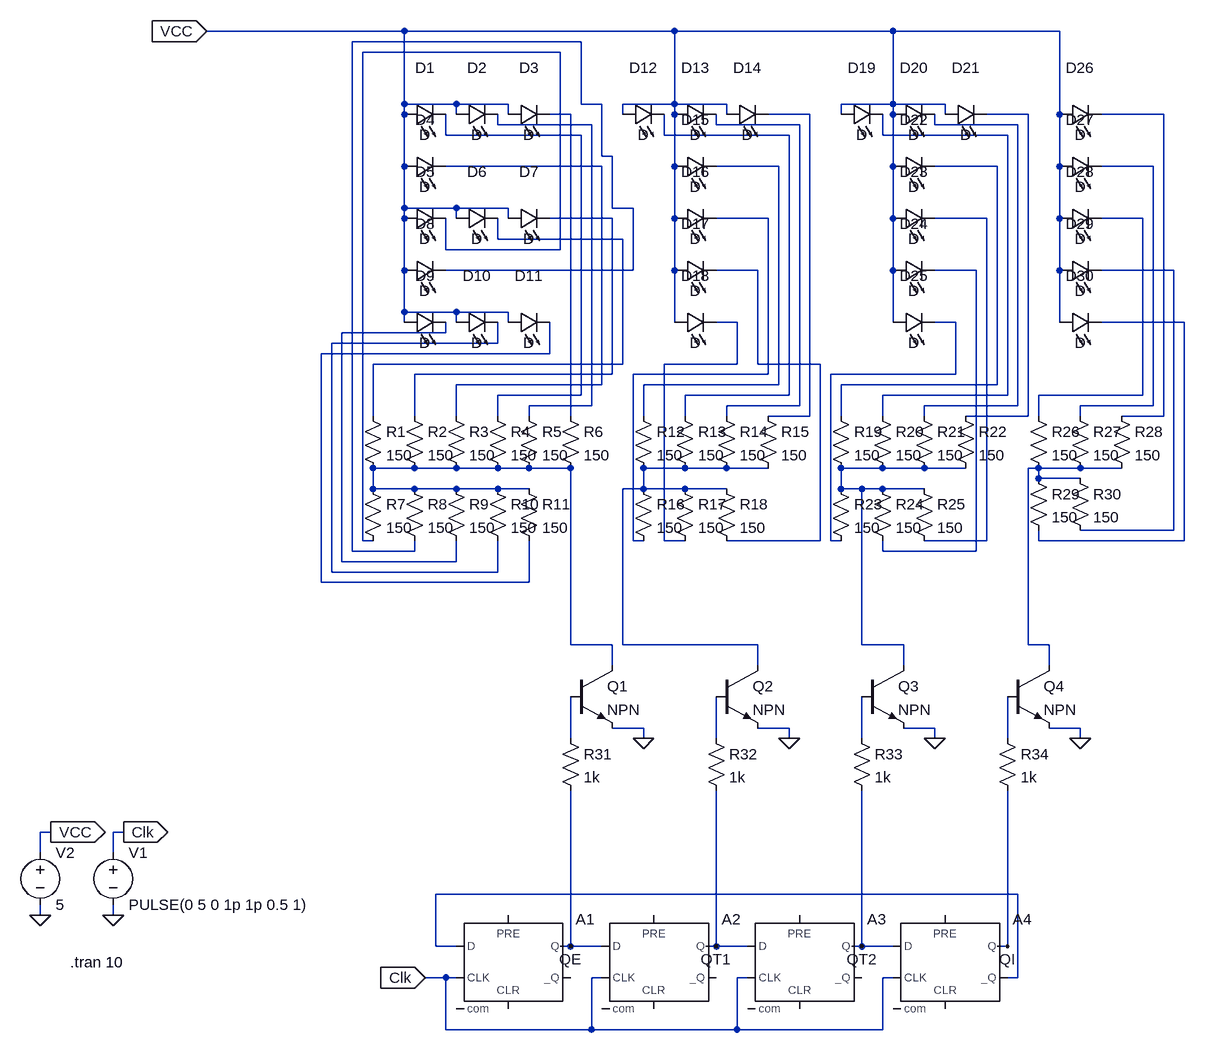
[diagram p0: schematic ETTI board LTSpice Model.asc]
ETTI board LTSpice Model.asc, the LTspice schematic file:
Version 4
SHEET 1 1332 680
WIRE 80 -944 -224 -944
WIRE 496 -944 80 -944
WIRE 832 -944 496 -944
WIRE 1088 -944 832 -944
WIRE 352 -928 0 -928
WIRE 320 -912 16 -912
WIRE 80 -832 80 -944
WIRE 160 -832 80 -832
WIRE 240 -832 160 -832
WIRE 352 -832 352 -928
WIRE 384 -832 352 -832
WIRE 496 -832 496 -944
WIRE 496 -832 416 -832
WIRE 576 -832 496 -832
WIRE 832 -832 832 -944
WIRE 832 -832 752 -832
WIRE 912 -832 832 -832
WIRE 80 -816 80 -832
WIRE 160 -816 160 -832
WIRE 240 -816 240 -832
WIRE 336 -816 304 -816
WIRE 416 -816 416 -832
WIRE 496 -816 496 -832
WIRE 576 -816 576 -832
WIRE 704 -816 640 -816
WIRE 752 -816 752 -832
WIRE 832 -816 832 -832
WIRE 912 -816 912 -832
WIRE 1040 -816 976 -816
WIRE 1088 -816 1088 -944
WIRE 1248 -816 1152 -816
WIRE 224 -800 224 -816
WIRE 368 -800 224 -800
WIRE 560 -800 560 -816
WIRE 688 -800 560 -800
WIRE 896 -800 896 -816
WIRE 1024 -800 896 -800
WIRE 144 -784 144 -816
WIRE 352 -784 144 -784
WIRE 480 -784 480 -816
WIRE 672 -784 480 -784
WIRE 816 -784 816 -816
WIRE 1008 -784 816 -784
WIRE 384 -752 384 -832
WIRE 400 -752 384 -752
WIRE 80 -736 80 -816
WIRE 384 -736 144 -736
WIRE 496 -736 496 -816
WIRE 656 -736 560 -736
WIRE 832 -736 832 -816
WIRE 992 -736 896 -736
WIRE 1088 -736 1088 -816
WIRE 1232 -736 1152 -736
WIRE 80 -672 80 -736
WIRE 160 -672 80 -672
WIRE 240 -672 160 -672
WIRE 400 -672 400 -752
WIRE 432 -672 400 -672
WIRE 80 -656 80 -672
WIRE 160 -656 160 -672
WIRE 240 -656 240 -672
WIRE 400 -656 304 -656
WIRE 496 -656 496 -736
WIRE 640 -656 560 -656
WIRE 832 -656 832 -736
WIRE 976 -656 896 -656
WIRE 1088 -656 1088 -736
WIRE 1216 -656 1152 -656
WIRE 224 -624 224 -656
WIRE 416 -624 224 -624
WIRE 144 -608 144 -656
WIRE 320 -608 320 -912
WIRE 320 -608 144 -608
WIRE 80 -576 80 -656
WIRE 432 -576 432 -672
WIRE 432 -576 144 -576
WIRE 496 -576 496 -656
WIRE 624 -576 560 -576
WIRE 832 -576 832 -656
WIRE 960 -576 896 -576
WIRE 1088 -576 1088 -656
WIRE 1264 -576 1152 -576
WIRE 80 -512 80 -576
WIRE 160 -512 80 -512
WIRE 240 -512 160 -512
WIRE 80 -496 80 -512
WIRE 160 -496 160 -512
WIRE 240 -496 240 -512
WIRE 496 -496 496 -576
WIRE 592 -496 560 -496
WIRE 832 -496 832 -576
WIRE 928 -496 896 -496
WIRE 1088 -496 1088 -576
WIRE 1280 -496 1152 -496
WIRE 144 -480 144 -496
WIRE 144 -480 -16 -480
WIRE 224 -464 224 -496
WIRE 224 -464 -32 -464
WIRE 304 -448 304 -496
WIRE 304 -448 -48 -448
WIRE 416 -432 416 -624
WIRE 416 -432 32 -432
WIRE 592 -432 592 -496
WIRE 592 -432 480 -432
WIRE 624 -432 624 -576
WIRE 720 -432 624 -432
WIRE 400 -416 400 -656
WIRE 400 -416 96 -416
WIRE 640 -416 640 -656
WIRE 640 -416 432 -416
WIRE 928 -416 928 -496
WIRE 928 -416 736 -416
WIRE 384 -400 384 -736
WIRE 384 -400 160 -400
WIRE 656 -400 656 -736
WIRE 656 -400 448 -400
WIRE 992 -400 992 -736
WIRE 992 -400 752 -400
WIRE 352 -384 352 -784
WIRE 352 -384 224 -384
WIRE 672 -384 672 -784
WIRE 672 -384 512 -384
WIRE 1008 -384 1008 -784
WIRE 1008 -384 816 -384
WIRE 1216 -384 1216 -656
WIRE 1216 -384 1056 -384
WIRE 368 -368 368 -800
WIRE 368 -368 272 -368
WIRE 688 -368 688 -800
WIRE 688 -368 576 -368
WIRE 1024 -368 1024 -800
WIRE 1024 -368 880 -368
WIRE 1232 -368 1232 -736
WIRE 1232 -368 1120 -368
WIRE 32 -352 32 -432
WIRE 96 -352 96 -416
WIRE 160 -352 160 -400
WIRE 224 -352 224 -384
WIRE 272 -352 272 -368
WIRE 336 -352 336 -816
WIRE 448 -352 448 -400
WIRE 512 -352 512 -384
WIRE 576 -352 576 -368
WIRE 704 -352 704 -816
WIRE 704 -352 640 -352
WIRE 752 -352 752 -400
WIRE 816 -352 816 -384
WIRE 880 -352 880 -368
WIRE 1040 -352 1040 -816
WIRE 1040 -352 944 -352
WIRE 1056 -352 1056 -384
WIRE 1120 -352 1120 -368
WIRE 1248 -352 1248 -816
WIRE 1248 -352 1184 -352
WIRE 96 -272 32 -272
WIRE 160 -272 96 -272
WIRE 224 -272 160 -272
WIRE 272 -272 224 -272
WIRE 336 -272 272 -272
WIRE 512 -272 448 -272
WIRE 576 -272 512 -272
WIRE 640 -272 576 -272
WIRE 816 -272 752 -272
WIRE 880 -272 816 -272
WIRE 944 -272 880 -272
WIRE 1056 -272 1040 -272
WIRE 1120 -272 1056 -272
WIRE 1184 -272 1120 -272
WIRE 1056 -256 1056 -272
WIRE 1120 -256 1056 -256
WIRE 32 -240 32 -272
WIRE 96 -240 32 -240
WIRE 160 -240 96 -240
WIRE 224 -240 160 -240
WIRE 272 -240 224 -240
WIRE 448 -240 448 -272
WIRE 448 -240 416 -240
WIRE 512 -240 448 -240
WIRE 576 -240 512 -240
WIRE 752 -240 752 -272
WIRE 784 -240 752 -240
WIRE 816 -240 784 -240
WIRE 880 -240 816 -240
WIRE 1264 -176 1264 -576
WIRE 1264 -176 1120 -176
WIRE 16 -160 16 -912
WIRE 32 -160 16 -160
WIRE 432 -160 432 -416
WIRE 448 -160 432 -160
WIRE 480 -160 480 -432
WIRE 512 -160 480 -160
WIRE 720 -160 720 -432
WIRE 720 -160 576 -160
WIRE 736 -160 736 -416
WIRE 752 -160 736 -160
WIRE 976 -160 976 -656
WIRE 976 -160 880 -160
WIRE 1056 -160 1056 -176
WIRE 1280 -160 1280 -496
WIRE 1280 -160 1056 -160
WIRE 0 -144 0 -928
WIRE 96 -144 96 -160
WIRE 96 -144 0 -144
WIRE 816 -144 816 -160
WIRE 960 -144 960 -576
WIRE 960 -144 816 -144
WIRE -16 -128 -16 -480
WIRE 160 -128 160 -160
WIRE 160 -128 -16 -128
WIRE -32 -112 -32 -464
WIRE 224 -112 224 -160
WIRE 224 -112 -32 -112
WIRE -48 -96 -48 -448
WIRE 272 -96 272 -160
WIRE 272 -96 -48 -96
WIRE 336 0 336 -272
WIRE 400 0 336 0
WIRE 416 0 416 -240
WIRE 624 0 416 0
WIRE 784 0 784 -240
WIRE 848 0 784 0
WIRE 1040 0 1040 -272
WIRE 1072 0 1040 0
WIRE 400 32 400 0
WIRE 624 32 624 0
WIRE 848 32 848 0
WIRE 1072 32 1072 0
WIRE 448 128 400 128
WIRE 672 128 624 128
WIRE 896 128 848 128
WIRE 1120 128 1072 128
WIRE 336 144 336 80
WIRE 448 144 448 128
WIRE 560 144 560 80
WIRE 672 144 672 128
WIRE 784 144 784 80
WIRE 896 144 896 128
WIRE 1008 144 1008 80
WIRE 1120 144 1120 128
WIRE -464 288 -480 288
WIRE -352 288 -368 288
WIRE -480 320 -480 288
WIRE -368 320 -368 288
WIRE 1024 384 128 384
WIRE -480 416 -480 400
WIRE -368 416 -368 400
WIRE 128 464 128 384
WIRE 160 464 128 464
WIRE 336 464 336 224
WIRE 336 464 320 464
WIRE 384 464 336 464
WIRE 560 464 560 224
WIRE 560 464 544 464
WIRE 608 464 560 464
WIRE 784 464 784 224
WIRE 784 464 768 464
WIRE 832 464 784 464
WIRE 1008 464 1008 224
WIRE 1008 464 992 464
WIRE 144 512 112 512
WIRE 160 512 144 512
WIRE 384 512 368 512
WIRE 608 512 592 512
WIRE 832 512 816 512
WIRE 1024 512 1024 384
WIRE 1024 512 1008 512
WIRE 144 592 144 512
WIRE 368 592 368 512
WIRE 368 592 144 592
WIRE 592 592 592 512
WIRE 592 592 368 592
WIRE 816 592 816 512
WIRE 816 592 592 592
FLAG -368 416 0
FLAG -352 288 Clk
IOPIN -352 288 Out
FLAG 112 512 Clk
IOPIN 112 512 In
FLAG -480 416 0
FLAG 448 144 0
FLAG 672 144 0
FLAG 896 144 0
FLAG 1120 144 0
FLAG -464 288 VCC
IOPIN -464 288 Out
FLAG -224 -944 VCC
IOPIN -224 -944 In
FLAG 336 464 QE
FLAG 560 464 QT1
FLAG 784 464 QT2
FLAG 1008 464 QI
SYMBOL Digital\\dflop 240 416 R0
WINDOW 3 0 0 Invisible 0
SYMATTR InstName A1
SYMATTR SpiceLine Td=2n Trise=10n Tfall=10n
SYMATTR Value2 Vhigh=5  Vlow=0
SYMATTR Value Ref=2.5
SYMATTR SpiceLine2 tripdt=5n
SYMBOL Digital\\dflop 464 416 R0
WINDOW 3 0 0 Invisible 0
SYMATTR InstName A2
SYMATTR SpiceLine Td=2n Trise=10n Tfall=10n
SYMATTR Value2 Vhigh=5  Vlow=0
SYMATTR Value Ref=2.5
SYMATTR SpiceLine2 tripdt=5n
SYMBOL Digital\\dflop 688 416 R0
WINDOW 3 0 0 Invisible 0
SYMATTR InstName A3
SYMATTR SpiceLine Td=2n Trise=10n Tfall=10n
SYMATTR Value2 Vhigh=5  Vlow=0
SYMATTR Value Ref=2.5
SYMATTR SpiceLine2 tripdt=5n
SYMBOL Digital\\dflop 912 416 R0
WINDOW 3 0 0 Invisible 0
SYMATTR InstName A4
SYMATTR SpiceLine Td=2n Trise=10n Tfall=10n
SYMATTR Value2 Vhigh=5  Vlow=0
SYMATTR Value Ref=2.5
SYMATTR SpiceLine2 tripdt=5n
SYMBOL voltage -368 304 R0
WINDOW 123 0 0 Left 0
WINDOW 39 0 0 Left 0
SYMATTR InstName V1
SYMATTR Value PULSE(0 5 0 1p 1p 0.5 1)
SYMBOL LED 80 -800 R270
WINDOW 0 72 32 VTop 2
WINDOW 3 0 32 VBottom 2
SYMATTR InstName D1
SYMBOL LED 160 -800 R270
WINDOW 0 72 32 VTop 2
WINDOW 3 0 32 VBottom 2
SYMATTR InstName D2
SYMBOL LED 240 -800 R270
WINDOW 0 72 32 VTop 2
WINDOW 3 0 32 VBottom 2
SYMATTR InstName D3
SYMBOL LED 80 -720 R270
WINDOW 0 72 32 VTop 2
WINDOW 3 0 32 VBottom 2
SYMATTR InstName D4
SYMBOL LED 80 -640 R270
WINDOW 0 72 32 VTop 2
WINDOW 3 0 32 VBottom 2
SYMATTR InstName D5
SYMBOL LED 160 -640 R270
WINDOW 0 72 32 VTop 2
WINDOW 3 0 32 VBottom 2
SYMATTR InstName D6
SYMBOL LED 240 -640 R270
WINDOW 0 72 32 VTop 2
WINDOW 3 0 32 VBottom 2
SYMATTR InstName D7
SYMBOL LED 80 -560 R270
WINDOW 0 72 32 VTop 2
WINDOW 3 0 32 VBottom 2
SYMATTR InstName D8
SYMBOL LED 80 -480 R270
WINDOW 0 72 32 VTop 2
WINDOW 3 0 32 VBottom 2
SYMATTR InstName D9
SYMBOL LED 160 -480 R270
WINDOW 0 72 32 VTop 2
WINDOW 3 0 32 VBottom 2
SYMATTR InstName D10
SYMBOL LED 240 -480 R270
WINDOW 0 72 32 VTop 2
WINDOW 3 0 32 VBottom 2
SYMATTR InstName D11
SYMBOL LED 416 -800 R270
WINDOW 0 72 32 VTop 2
WINDOW 3 0 32 VBottom 2
SYMATTR InstName D12
SYMBOL LED 496 -800 R270
WINDOW 0 72 32 VTop 2
WINDOW 3 0 32 VBottom 2
SYMATTR InstName D13
SYMBOL LED 576 -800 R270
WINDOW 0 72 32 VTop 2
WINDOW 3 0 32 VBottom 2
SYMATTR InstName D14
SYMBOL LED 496 -720 R270
WINDOW 0 72 32 VTop 2
WINDOW 3 0 32 VBottom 2
SYMATTR InstName D15
SYMBOL LED 496 -640 R270
WINDOW 0 72 32 VTop 2
WINDOW 3 0 32 VBottom 2
SYMATTR InstName D16
SYMBOL LED 496 -560 R270
WINDOW 0 72 32 VTop 2
WINDOW 3 0 32 VBottom 2
SYMATTR InstName D17
SYMBOL LED 496 -480 R270
WINDOW 0 72 32 VTop 2
WINDOW 3 0 32 VBottom 2
SYMATTR InstName D18
SYMBOL LED 752 -800 R270
WINDOW 0 72 32 VTop 2
WINDOW 3 0 32 VBottom 2
SYMATTR InstName D19
SYMBOL LED 832 -800 R270
WINDOW 0 72 32 VTop 2
WINDOW 3 0 32 VBottom 2
SYMATTR InstName D20
SYMBOL LED 912 -800 R270
WINDOW 0 72 32 VTop 2
WINDOW 3 0 32 VBottom 2
SYMATTR InstName D21
SYMBOL LED 832 -720 R270
WINDOW 0 72 32 VTop 2
WINDOW 3 0 32 VBottom 2
SYMATTR InstName D22
SYMBOL LED 832 -640 R270
WINDOW 0 72 32 VTop 2
WINDOW 3 0 32 VBottom 2
SYMATTR InstName D23
SYMBOL LED 832 -560 R270
WINDOW 0 72 32 VTop 2
WINDOW 3 0 32 VBottom 2
SYMATTR InstName D24
SYMBOL LED 832 -480 R270
WINDOW 0 72 32 VTop 2
WINDOW 3 0 32 VBottom 2
SYMATTR InstName D25
SYMBOL LED 1088 -800 R270
WINDOW 0 72 32 VTop 2
WINDOW 3 0 32 VBottom 2
SYMATTR InstName D26
SYMBOL LED 1088 -720 R270
WINDOW 0 72 32 VTop 2
WINDOW 3 0 32 VBottom 2
SYMATTR InstName D27
SYMBOL LED 1088 -640 R270
WINDOW 0 72 32 VTop 2
WINDOW 3 0 32 VBottom 2
SYMATTR InstName D28
SYMBOL LED 1088 -560 R270
WINDOW 0 72 32 VTop 2
WINDOW 3 0 32 VBottom 2
SYMATTR InstName D29
SYMBOL LED 1088 -480 R270
WINDOW 0 72 32 VTop 2
WINDOW 3 0 32 VBottom 2
SYMATTR InstName D30
SYMBOL res 16 -368 R0
SYMATTR InstName R1
SYMATTR Value 150
SYMBOL res 80 -368 R0
SYMATTR InstName R2
SYMATTR Value 150
SYMBOL res 144 -368 R0
SYMATTR InstName R3
SYMATTR Value 150
SYMBOL res 208 -368 R0
SYMATTR InstName R4
SYMATTR Value 150
SYMBOL res 256 -368 R0
SYMATTR InstName R5
SYMATTR Value 150
SYMBOL res 320 -368 R0
SYMATTR InstName R6
SYMATTR Value 150
SYMBOL res 16 -256 R0
SYMATTR InstName R7
SYMATTR Value 150
SYMBOL res 80 -256 R0
SYMATTR InstName R8
SYMATTR Value 150
SYMBOL res 144 -256 R0
SYMATTR InstName R9
SYMATTR Value 150
SYMBOL res 208 -256 R0
SYMATTR InstName R10
SYMATTR Value 150
SYMBOL res 256 -256 R0
SYMATTR InstName R11
SYMATTR Value 150
SYMBOL res 432 -368 R0
SYMATTR InstName R12
SYMATTR Value 150
SYMBOL res 496 -368 R0
SYMATTR InstName R13
SYMATTR Value 150
SYMBOL res 560 -368 R0
SYMATTR InstName R14
SYMATTR Value 150
SYMBOL res 624 -368 R0
SYMATTR InstName R15
SYMATTR Value 150
SYMBOL res 432 -256 R0
SYMATTR InstName R16
SYMATTR Value 150
SYMBOL res 496 -256 R0
SYMATTR InstName R17
SYMATTR Value 150
SYMBOL res 560 -256 R0
SYMATTR InstName R18
SYMATTR Value 150
SYMBOL res 736 -368 R0
SYMATTR InstName R19
SYMATTR Value 150
SYMBOL res 800 -368 R0
SYMATTR InstName R20
SYMATTR Value 150
SYMBOL res 864 -368 R0
SYMATTR InstName R21
SYMATTR Value 150
SYMBOL res 928 -368 R0
SYMATTR InstName R22
SYMATTR Value 150
SYMBOL res 736 -256 R0
SYMATTR InstName R23
SYMATTR Value 150
SYMBOL res 800 -256 R0
SYMATTR InstName R24
SYMATTR Value 150
SYMBOL res 864 -256 R0
SYMATTR InstName R25
SYMATTR Value 150
SYMBOL res 1040 -368 R0
SYMATTR InstName R26
SYMATTR Value 150
SYMBOL res 1104 -368 R0
SYMATTR InstName R27
SYMATTR Value 150
SYMBOL res 1168 -368 R0
SYMATTR InstName R28
SYMATTR Value 150
SYMBOL res 1040 -272 R0
SYMATTR InstName R29
SYMATTR Value 150
SYMBOL res 1104 -272 R0
SYMATTR InstName R30
SYMATTR Value 150
SYMBOL npn 336 32 R0
SYMATTR InstName Q1
SYMBOL npn 560 32 R0
SYMATTR InstName Q2
SYMBOL npn 784 32 R0
SYMATTR InstName Q3
SYMBOL npn 1008 32 R0
SYMATTR InstName Q4
SYMBOL res 320 128 R0
SYMATTR InstName R31
SYMATTR Value 1k
SYMBOL res 544 128 R0
SYMATTR InstName R32
SYMATTR Value 1k
SYMBOL res 768 128 R0
SYMATTR InstName R33
SYMATTR Value 1k
SYMBOL res 992 128 R0
SYMATTR InstName R34
SYMATTR Value 1k
SYMBOL voltage -480 304 R0
WINDOW 123 0 0 Left 0
WINDOW 39 0 0 Left 0
SYMATTR InstName V2
SYMATTR Value 5
TEXT -434 488 Left 2 !.tran 10

The netlist it stands for:
* ETTI board LTSpice Model.asc
A1 N039 0 Clk 0 0 0 QE 0 DFLOP Ref=2.5 Vhigh=5  Vlow=0 Td=2n Trise=10n Tfall=10n tripdt=5n
A2 QE 0 Clk 0 0 0 QT1 0 DFLOP Ref=2.5 Vhigh=5  Vlow=0 Td=2n Trise=10n Tfall=10n tripdt=5n
A3 QT1 0 Clk 0 0 0 QT2 0 DFLOP Ref=2.5 Vhigh=5  Vlow=0 Td=2n Trise=10n Tfall=10n tripdt=5n
A4 QT2 0 Clk 0 0 N039 QI 0 DFLOP Ref=2.5 Vhigh=5  Vlow=0 Td=2n Trise=10n Tfall=10n tripdt=5n
V1 Clk 0 PULSE(0 5 0 1p 1p 0.5 1)
D1 VCC N010 D
D2 VCC N007 D
D3 VCC N003 D
D4 VCC N013 D
D5 VCC N002 D
D6 VCC N021 D
D7 VCC N017 D
D8 VCC N001 D
D9 VCC N028 D
D10 VCC N029 D
D11 VCC N030 D
D12 VCC N011 D
D13 VCC N008 D
D14 VCC N004 D
D15 VCC N014 D
D16 VCC N018 D
D17 VCC N022 D
D18 VCC N025 D
D19 VCC N012 D
D20 VCC N009 D
D21 VCC N005 D
D22 VCC N015 D
D23 VCC N019 D
D24 VCC N023 D
D25 VCC N026 D
D26 VCC N006 D
D27 VCC N016 D
D28 VCC N020 D
D29 VCC N024 D
D30 VCC N027 D
R1 N021 N031 150
R2 N017 N031 150
R3 N013 N031 150
R4 N010 N031 150
R5 N007 N031 150
R6 N003 N031 150
R7 N031 N002 150
R8 N031 N001 150
R9 N031 N028 150
R10 N031 N029 150
R11 N031 N030 150
R12 N014 N032 150
R13 N011 N032 150
R14 N008 N032 150
R15 N004 N032 150
R16 N032 N018 150
R17 N032 N025 150
R18 N032 N022 150
R19 N015 N033 150
R20 N012 N033 150
R21 N009 N033 150
R22 N005 N033 150
R23 N033 N026 150
R24 N033 N023 150
R25 N033 N019 150
R26 N020 N034 150
R27 N016 N034 150
R28 N006 N034 150
R29 N034 N027 150
R30 N034 N024 150
Q1 N031 N035 0 0 NPN
Q2 N032 N036 0 0 NPN
Q3 N033 N037 0 0 NPN
Q4 N034 N038 0 0 NPN
R31 N035 QE 1k
R32 N036 QT1 1k
R33 N037 QT2 1k
R34 N038 QI 1k
V2 VCC 0 5
.model D D
.lib standard.dio
.model NPN NPN
.model PNP PNP
.lib standard.bjt
.tran 10
.backanno
.end